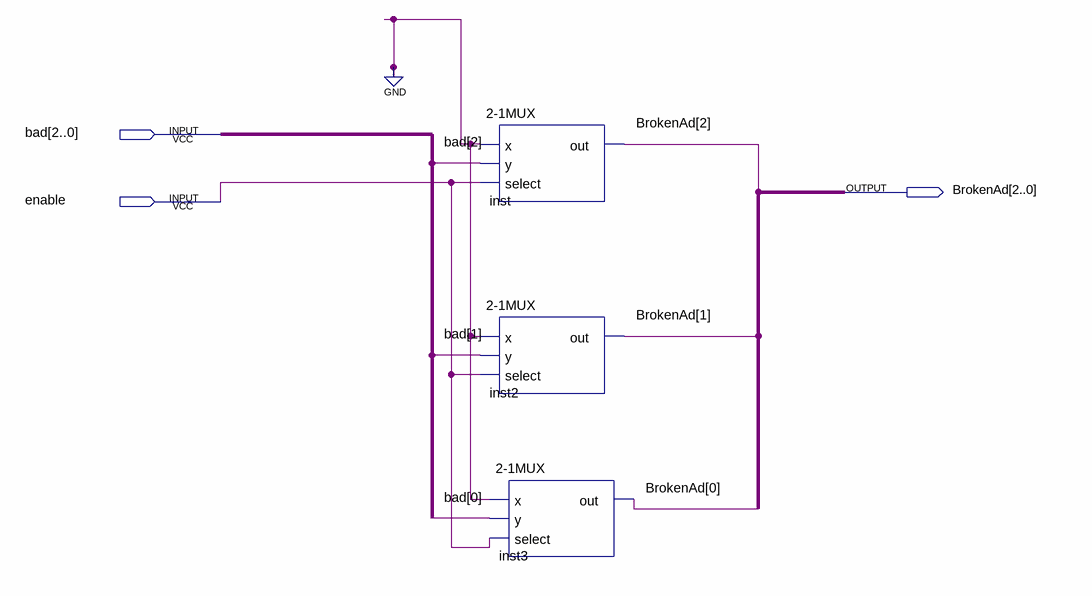
[diagram p0: schematic sheet]
// Quartus schematic BrokenAd.bdf as structural Verilog: 3 symbols, 3 pins
module BrokenAd (
  input  [2:0] bad,
  input  enable,
  output [2:0] BrokenAd
);

  \2-1MUX  inst (.x(1'b0), .y(bad[2]), .select(enable), .out(BrokenAd[2]));
  \2-1MUX  inst2 (.x(1'b0), .y(bad[1]), .select(enable), .out(BrokenAd[1]));
  \2-1MUX  inst3 (.x(1'b0), .y(bad[0]), .select(enable), .out(BrokenAd[0]));
endmodule
